# Altium schematic sheet LAUNCHXL-F28069_B_1400922_0.SchDoc: LAUNCHXL-F28069_B_1400922
size 301 x 234 mm; Origin: Eagle; Date: 2014/12/8 15:08:46; SheetNumber: 1; GateName_1: G$1; SymbolName_1: FRAME_A_L; LibraryName: frames; DeviceSetName: FRAME_A_L; GateName_2: G$2; SymbolName_2: DOCFIELD; Sheet: Sheet:; REV: REV:; COMPANY: COMPANY:; Scale:1/1: Scale: 1/1; Drawn: Drawn; Checked: Checked; Approved: Approved; Embest: Embest
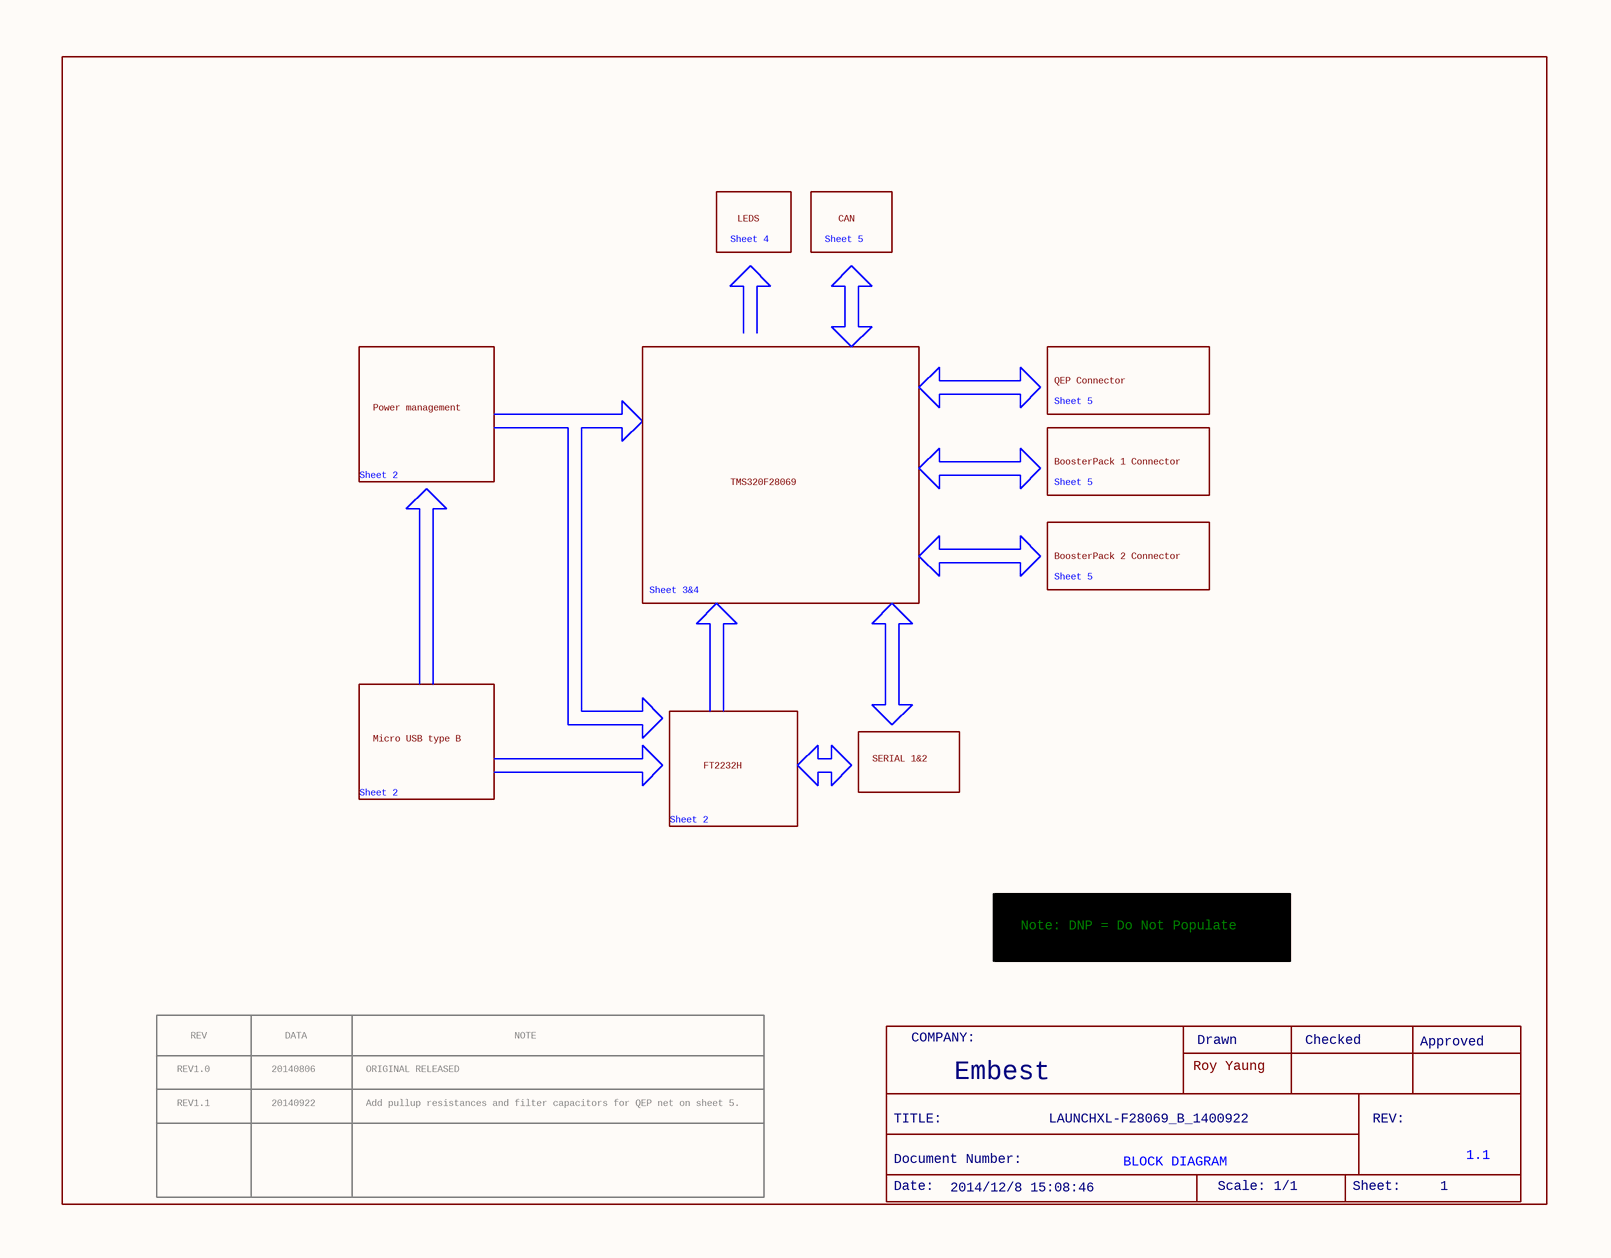
[diagram p0: LAUNCHXL-F28069_B_1400922_0.SchDoc]

## Notes on the sheet
- Sheet 4
- LEDS
- Sheet 5
- CAN
- QEP Connector
- Power management
- BoosterPack 1 Connector
- Sheet 2
- TMS320F28069
- Sheet 3&4
- BoosterPack 2 Connector
- Micro USB type B
- FT2232H
- SERIAL 1&2
- Note: DNP = Do Not Populate
- REV1.0
- REV
- 20140806
- DATA
- ORIGINAL RELEASED
- NOTE
- COMPANY:
- Roy Yaung
- Drawn
- Checked
- Approved
- REV1.1
- 20140922
- Add pullup resistances and filter capacitors for QEP net on sheet 5.
- TITLE:
- Embest
- LAUNCHXL-F28069_B_1400922
- REV:
- Date:
- Document Number:
- 2014/12/8 15:08:46
- BLOCK DIAGRAM
- Scale: 1/1
- Sheet:
- 1
- 1.1